# EAGLE design Bodenfeuchte_RFduino (EAGLE 7.0.0)
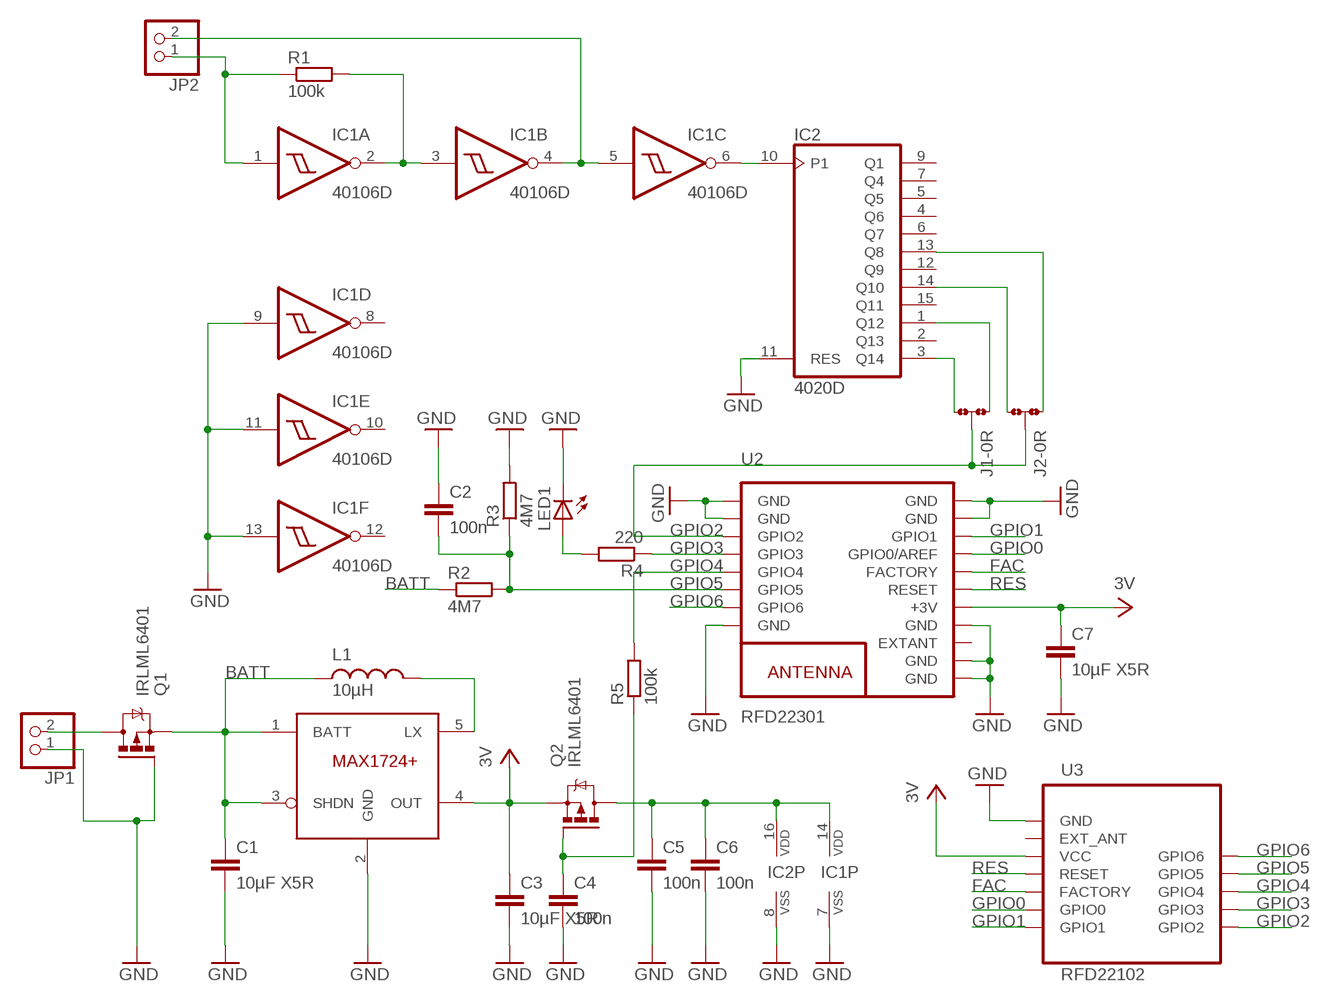
[diagram p0: schematic, sheet 1]

## Parts
C1  10µF X5R  C-EUC0805  [C0805]
C2  100n  C-EUC0805  [C0805]
C3  10µF X5R  C-EUC0805  [C0805]
C4  100n  C-EUC0805  [C0805]
C5  100n  C-EUC0805  [C0805]
C6  100n  C-EUC0805  [C0805]
C7  10µF X5R  C-EUC0805  [C0805]
IC1  40106D  [SO14]
IC2  4020D  [SO16]
J1  0R-JUMPA  [A0R-JMP]
J2  0R-JUMPA  [A0R-JMP]
JP1  PINHD-1X2  [1X02]
JP2  PINHD-1X2  [1X02]
L1  10µH  DS1608C  [DS1608]
LED1  LEDCHIPLED_1206  [CHIPLED_1206]
Q1  IRLML6401  IRLML5203  [MICRO3]
Q2  IRLML6401  IRLML5203  [MICRO3]
R1  100k  R-EU_R0805  [R0805]
R2  4M7  R-EU_R0805  [R0805]
R3  4M7  R-EU_R0805  [R0805]
R4  220  R-EU_R0805  [R0805]
R5  100k  R-EU_R0805  [R0805]
U1  MAX1724  [SOT23-5L]
U2  RFD22301  [RFD22301]
U3  RFD22102  [RFD22102]

## Nets
BATT: C1.1 L1.P$2 Q1.2(S) R2.1 U1.1(BATT) U1.3(SHDN)
FAC: U2.15(FACTORY) U3.FACTORY
GND: C1.2 C2.1 C3.2 C4.2 C5.2 C6.2 C7.2 IC1.7(P:VSS) IC1.9(D:I) IC1.11(E:I) IC1.13(F:I) IC2.8(VSS) IC2.11(RES) JP1.1 LED1.C Q1.1(G) R3.2 U1.2(GND) U2.1(GND) U2.2(GND) U2.8(GND) U2.9(GND) U2.10(GND) U2.12(GND) U2.18(GND) U2.19(GND) U3.GND
GPIO0: U2.16(GPIO0/AREF) U3.GPIO0
GPIO1: U2.17(GPIO1) U3.GPIO1
GPIO2: J1.2 J2.2 U2.3(GPIO2) U3.GPIO2
GPIO3: R4.1 U2.4(GPIO3) U3.GPIO3
GPIO4: R5.2 U2.5(GPIO4) U3.GPIO4
GPIO5: C2.2 R2.2 R3.1 U2.6(GPIO5) U3.GPIO5
GPIO6: U2.7(GPIO6) U3.GPIO6
N$1: L1.P$1 U1.5(LX)
N$2: JP1.2 Q1.3(D)
N$3: LED1.A R4.2
N$4: IC2.1(Q12) J1.1
N$5: IC1.6(C:O) IC2.10(P1)
N$6: IC1.4(B:O) IC1.5(C:I) JP2.2
N$7: IC1.2(A:O) IC1.3(B:I) R1.2
N$8: C4.1 Q2.1(G) R5.1
N$9: C5.1 C6.1 IC1.14(P:VDD) IC2.16(VDD) Q2.3(D)
N$10: IC1.1(A:I) JP2.1 R1.1
N$11: IC2.14(Q10) J2.3
N$12: IC2.13(Q8) J2.1
N$14: IC2.3(Q14) J1.3
RES: U2.14(RESET) U3.RESET
VCC: C3.1 C7.1 Q2.2(S) U1.4(OUT) U2.13(+3V) U3.VCC ; supply symbol labelled 3V
Unconnected: IC1.8(D:O) IC1.10(E:O) IC1.12(F:O) IC2.2(Q13) IC2.4(Q6) IC2.5(Q5) IC2.6(Q7) IC2.7(Q4) IC2.9(Q1) IC2.12(Q9) IC2.15(Q11) U2.11(EXTANT) U3.EXT_ANT

## Library data of the parts
C1-C7 = resistor:C-EU: CAPACITOR, European symbol
IC1 = 40xx:40106: Hex SCHMITT TRIGGER
IC2 = 40xx:4020: 14-stage binary/ripple COUNTER
J1 J2 = jump-0r-smd:0R-JUMP: SMD 0R 0805 Jumper
JP1 JP2 = pinhead:PINHD-1X2: PIN HEADER
L1 = inductor-coilcraft_2:DS1608: SMT Power Inductors
LED1 = led:LED: LED OSRAM: - CHIPLED LG R971, LG N971, LY N971, LG Q971, LY Q971, LO R971, LY R971 LH N974, LH R974 LS Q976, LO Q976, LY Q976 LO Q996 - Hyper CHIPLED LW Q18S LB Q993, LB Q99A, LB R99A - SideLED LS A670, LO A670, LY A670, LG A670, LP A670 LB A673, LV A673, LT A673, LW A673 LH A674 LY A675 LS A676, LA A676, LO A676, LY A676, LW A676 LS A679, LY A679, LG A679 - Hyper Micro SIDELED® LS Y876, LA Y876, LO Y876, LY Y876 LT Y87S - SmartLED LW L88C, LW L88S LB L89C, LB L89S, LG L890 LS L89K, LO L89K, LY L89K LS L896, LA L896, LO L896, LY L896 - TOPLED LS T670, LO T670, LY T670, LG T670, LP T670 LSG T670, LSP T670, LSY T670, LOP T670, LYG T670 LG T671, LOG T671, LSG T671 LB T673, LV T673, LT T673, LW T673 LH T674 LS T676, LA T676, LO T676, LY T676, LB T676, LH T676, LSB T676, LW T676 LB T67C, LV T67C, LT T67C, LS T67K, LO T67K, LY T67K, LW E67C LS E67B, LA E67B, LO E67B, LY E67B, LB E67C, LV E67C, LT E67C LW T67C LS T679, LY T679, LG T679 LS T770, LO T770, LY T770, LG T770, LP T770 LB T773, LV T773, LT T773, LW T773 LH T774 LS E675, LA E675, LY E675, LS T675 LS T776, LA T776, LO T776, LY T776, LB T776 LHGB T686 LT T68C, LB T68C - Hyper Mini TOPLED® LB M676 - Mini TOPLED Santana® LG M470 LS M47K, LO M47K, LY M47K Source: http://www.osram.convergy.de LUXEON: - LUMILED® LXK2-PW12-R00, LXK2-PW12-S00, LXK2-PW14-U00, LXK2-PW14-V00 LXK2-PM12-R00, LXK2-PM12-S00, LXK2-PM14-U00 LXK2-PE12-Q00, LXK2-PE12-R00, LXK2-PE12-S00, LXK2-PE14-T00, LXK2-PE14-U00 LXK2-PB12-K00, LXK2-PB12-L00, LXK2-PB12-M00, LXK2-PB14-N00, LXK2-PB14-P00, LXK2-PB14-Q00 LXK2-PR12-L00, LXK2-PR12-M00, LXK2-PR14-Q00, LXK2-PR14-R00 LXK2-PD12-Q00, LXK2-PD12-R00, LXK2-PD12-S00 LXK2-PH12-R00, LXK2-PH12-S00 LXK2-PL12-P00, LXK2-PL12-Q00, LXK2-PL12-R00 Source: www.luxeon.com KINGBRIGHT: KA-3528ASYC Source: www.kingbright.com
Q1 Q2 = transistor-power:IRLML5203: HEXFET P-Channel Power MOSFET
R1-R5 = rcl:R-EU_: RESISTOR, European symbol
U1 = MAX1724:MAX1724
U2 = RF_Digital_RFD22301_Eagle_Schematic_PCB_Library:RFD22301: RFD22301 RFduino SMT Module RFD22301 Datasheet: http://www.rfdigital.com/wp-content/uploads/2014/03/RFD22301.Data_.Sheet_.11.24.13_11.38PM.pdf
U3 = RF_Digital_RFD22102_Eagle_Schematic_PCB_Library:RFD22102: RFD22102 RFduino DIP module RFduino Datasheet: http://www.rfdigital.com/wp-content/uploads/2014/03/rfduino.datasheet.pdf

## Board
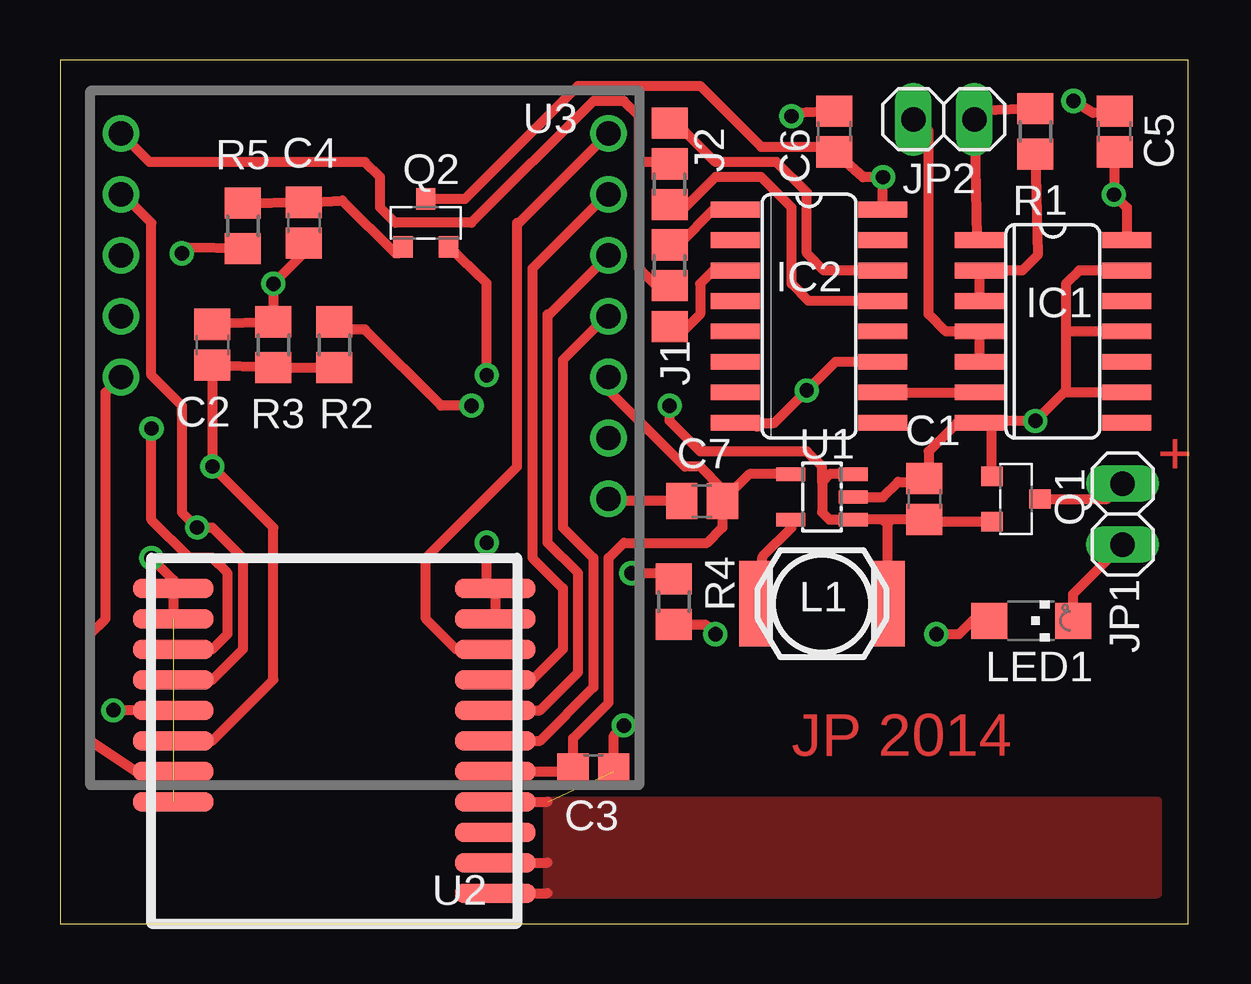
[diagram p1: board, top side]
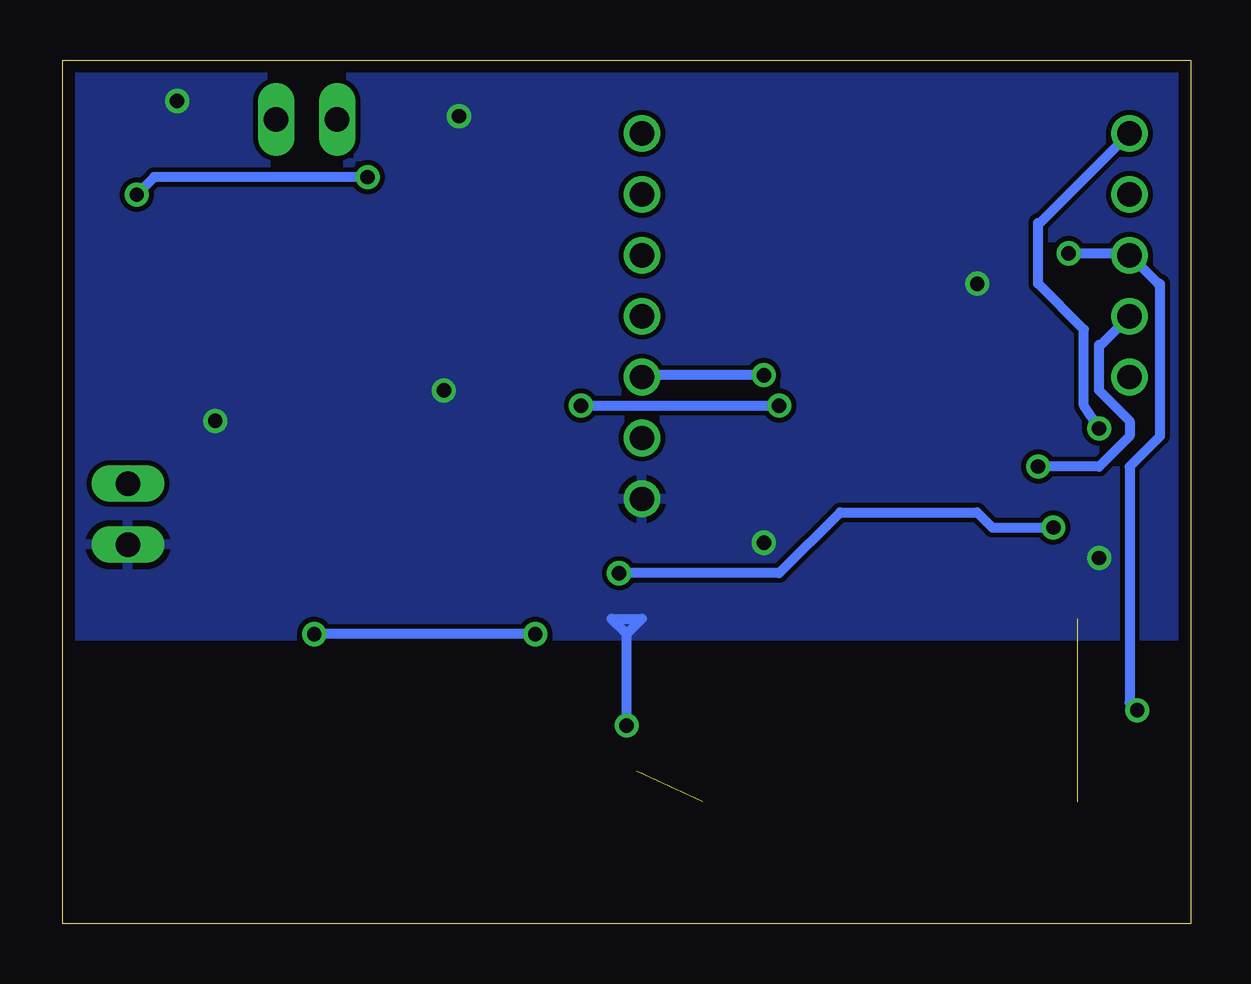
[diagram p2: board, bottom side, seen from below]

Size 47 x 36 mm. Coordinates in mm from the lower left corner, seen from the top.
Outline: 0,0 47,0 47,36 0,36 0,0
Copper layers (1*16): Top 0.035mm / dielectric 1.5mm / Bottom 0.035mm
Design rules "default *": minimum track width 10mil, minimum drill 13mil, track to track 8mil, track to pad 8mil, pad to pad 8mil, via to via 8mil, smd to smd 8mil, copper to edge 20mil, drill to drill 8mil, minimum pad ring 10mil, minimum via ring 8mil, stop-mask expansion 4mil, vias tented up to drill 0mil, thermal gap 10mil

### Footprints (pad centres in the part's own frame; a part is rotated, then mirrored left to right if it is on the bottom)
C0805 = smd 1.3 x 1.5: 1 -0.85,0; 2 0.85,0
SO14 = smd 0.66 x 2.032: 1 -3.81,-3.073; 2 -2.54,-3.073; 3 -1.27,-3.073; 4 0,-3.073; 5 1.27,-3.073; 6 2.54,-3.073; 7 3.81,-3.073; 8 3.81,3.073; 9 2.54,3.073; 10 1.27,3.073; 11 0,3.073; 12 -1.27,3.073; 13 -2.54,3.073; 14 -3.81,3.073
SO16 = smd 0.66 x 2.032: 1 -4.445,-3.073; 2 -3.175,-3.073; 3 -1.905,-3.073; 4 -0.635,-3.073; 5 0.635,-3.073; 6 1.905,-3.073; 7 3.175,-3.073; 8 4.445,-3.073; 9 4.445,3.073; 10 3.175,3.073; 11 1.905,3.073; 12 0.635,3.073; 13 -0.635,3.073; 14 -1.905,3.073; 15 -3.175,3.073; 16 -4.445,3.073
A0R-JMP = smd 1.5 x 1.3: 1 0,1.7; 2 0,0; 3 0,-1.7
1X02 = drill 1.016 long: 1 -1.27,0; 2 1.27,0
DS1608 = smd 1.397 x 3.556: P$1 -2.743,0; P$2 2.743,0
CHIPLED_1206 = smd 1.5 x 1.5: A 0,-1.75; C 0,1.75
MICRO3 = smd 0.8 x 0.9: 1 -0.95,-1; 2 0.95,-1; 3 0,1
R0805 = smd 1.3 x 1.5: 1 -0.95,0; 2 0.95,0
SOT23-5L = smd 0.55 x 1.2: 1 -0.95,-1.3; 2 0,-1.3; 3 0.95,-1.3; 4 0.95,1.3; 5 -0.95,1.3
RFD22301 = smd 3.353 x 0.813: 1 -6.706,7.62; 2 -6.706,6.35; 3 -6.706,5.08; 4 -6.706,3.81; 5 -6.706,2.54; 6 -6.706,1.27; 7 -6.706,0; 8 -6.706,-1.27; 9 6.706,-5.08; 10 6.706,-3.81; 11 6.706,-2.54; 12 6.706,-1.27; 13 6.706,0; 14 6.706,1.27; 15 6.706,2.54; 16 6.706,3.81; 17 6.706,5.08; 18 6.706,6.35; 19 6.706,7.62
RFD22102 = drill 1.016: EXT_ANT -10.16,0; FACTORY -10.16,-7.62; GND -10.16,2.54; GPIO0 -10.16,-10.16; GPIO1 -10.16,-12.7; GPIO2 10.16,-12.7; GPIO3 10.16,-10.16; GPIO4 10.16,-7.62; GPIO5 10.16,-5.08; GPIO6 10.16,-2.54; RESET -10.16,-5.08; VCC -10.16,-2.54

### Placement (x,y rotation side)
C1  36.02,17.7 90 top
C2  6.35,24.13 270 top
C3  22.23,6.35 0 top
C4  10.16,29.21 270 top
C5  43.94,33.02 90 top
C6  32.26,33.02 90 top
C7  26.75,17.61 180 top
IC1  41.37,24.68 270 top
IC2  31.21,25.32 270 top
J1  25.4,26.59 0 top
J2  25.4,31.67 180 top
JP1  44.27,17.07 90 top
JP2  36.83,33.53 180 top
L1  31.75,13.34 0 top
LED1  40.47,12.62 270 top
Q1  39.83,17.7 270 top
Q2  15.24,29.21 0 top
R1  40.64,33.02 270 top
R2  11.43,24.13 270 top
R3  8.89,24.13 90 top
R4  25.57,13.41 270 top
R5  7.62,29.08 270 top
U1  31.75,17.78 90 top
U2  11.43,6.35 0 top
U3  12.7,20.24 180 top

### Tracks (layer width: path | path; a pad name or v marks a point on that pad's centre or on a via)
BATT  (via drill 0.6)
  Top 0.406: v17.14,21.59 15.88,21.59 12.7,24.77 11.66,24.77 R2.1 | U1.3 32.06,18.73 31.75,18.41 | 31.75,18.41 31.75,17.14 32.06,16.83 U1.1 33.07,16.85 34.29,16.85 | 34.29,16.85 C1.1 36.12,16.75 Q1.2 | 31.75,18.41 31.75,19.05 31.11,19.68 26.67,19.68 25.4,20.95 v25.4,21.59 | L1.P$2 34.49,16.65 34.29,16.85
  Bottom 0.406: v25.4,21.59 v17.14,21.59
FAC
  Top 0.406: U3.FACTORY 20.4,25.4 20.32,25.4 20.32,15.88 21.59,14.61 21.59,10.48 20,8.89 U2.15
GND  (via drill 0.6)  (2 unrouted)
  Top 0.406: C4.2 10.16,27.94 v8.89,26.67 R3.2 6.45,25 C2.1 | U2.2 U2.1 4.72,14.33 v3.81,15.24 | U2.18 U2.19 17.78,13.97 v17.78,15.88 | C6.2 30.61,33.79 v30.48,33.66 | IC1.9 41.83,22.14 | 41.83,22.14 v40.64,20.95 38.73,20.95 | IC2.8 29.21,20.88 | 29.21,20.88 29.77,20.88 v31.11,22.23 32.3,23.41 IC2.11 | 29.04,20.7 29.21,20.88 | IC1.13 42.47,27.23 41.91,26.67 41.91,24.77 | 41.91,24.77 41.91,22.23 41.83,22.14 | IC1.11 41.99,24.68 41.91,24.77 | U1.2 34.29,17.78 34.92,18.41 35.88,18.41 C1.2 36.2,18.73 36.2,19.68 37.38,20.88 IC1.7 38.38,20.95 38.73,20.95 | C5.2 43.05,33.79 v42.23,34.29 | Q1.1 38.83,20.86 38.73,20.95 | 26.04,17.47 C7.2 22.95,17.61 U3.GND | C3.2 23.07,7.83 v23.5,8.26 | U2.12 20.32,5.08 | U2.10 20.32,2.54 | U2.9 20.32,1.27 | LED1.C 42.22,13.73 JP1.1
  Bottom 0.406: v23.5,8.26 23.5,12.06 | 23.5,12.06 24.13,12.7 22.86,12.7 23.5,12.06
  pour Bottom: 0,12 47,12 47,36 0,36
  pour Top: 20.32,1.27 45.72,1.27 45.72,5.08 20.32,5.08
GPIO0
  Top 0.406: U2.16 19.68,10.16 20.95,11.43 20.95,13.97 19.68,15.24 19.68,27.3 22.78,30.4 U3.GPIO0
GPIO1
  Top 0.406: U2.17 16.51,11.43 15.24,12.7 15.24,15.24 19.05,19.05 19.05,29.21 19.13,29.21 U3.GPIO1
GPIO2  (via drill 0.6)
  Top 0.406: U2.3 6.35,11.43 6.99,12.06 6.99,14.61 6.35,15.24 5.4,15.24 3.81,16.83 v3.81,20.64 | J1.2 24.84,26.59 24.13,27.3 24.13,31.75 | 24.13,31.75 24.13,33.66 23.5,34.29 22.23,34.29 17.14,29.21 13.97,29.21 13.34,29.84 13.34,31.11 12.7,31.75 3.73,31.75 U3.GPIO2 | J2.2 25.32,31.75 24.13,31.75
  Bottom 0.406: v3.81,20.64 4.45,21.59 4.45,24.77 6.35,26.67 6.35,29.21 6.27,29.21 U3.GPIO2
GPIO3  (via drill 0.6)
  Top 0.406: U3.GPIO3 2.62,30.4 3.81,29.21 3.81,22.86 5.08,21.59 5.08,17.14 v5.71,16.51 6.35,16.51 7.62,15.24 7.62,11.43 6.35,10.16 U2.4 | v23.81,14.61 25.34,14.61 R4.1
  Bottom 0.406: v5.71,16.51 8.26,16.51 8.89,17.14 14.61,17.14 17.14,14.61 v23.81,14.61
GPIO4  (via drill 0.6)
  Top 0.406: U2.5 v2.22,8.89 | R5.2 5.32,28.18 v5.08,27.94
  Bottom 0.406: v5.08,27.94 2.62,27.94 U3.GPIO4 1.35,26.67 1.27,26.67 1.27,20.32 2.54,19.05 2.54,9.21 v2.22,8.89
GPIO5  (via drill 0.6)
  Top 0.406: R2.2 R3.1 8.79,23.2 C2.2 v6.35,19.05 8.89,16.51 8.89,10.16 6.35,7.62 U2.6
  Bottom 0.406: U3.GPIO5 3.73,24.13 3.81,24.13 3.81,22.23 2.54,20.95 2.54,20.32 3.81,19.05 v6.35,19.05
GPIO6
  Top 0.406: U2.7 3.17,6.35 1.27,7.62 1.27,12.06 1.91,12.7 1.91,22.14 U3.GPIO6
N$1
  Top 0.406: L1.P$1 29.29,15.32 30.48,16.51 30.48,16.8 U1.5
N$2
  Top 0.406: Q1.3 43.64,17.7 JP1.2
N$3  (via drill 0.6)
  Top 0.406: R4.2 26.91,12.46 v27.3,12.06 | v36.51,12.06 37.47,12.06 38.1,12.7 38.63,12.7 LED1.A
  Bottom 0.406: v27.3,12.06 v36.51,12.06
N$4
  Top 0.406: J1.1 25.75,28.29 27.3,29.84 28.06,29.84 IC2.1
N$5
  Top 0.406: IC2.10 IC1.6
N$6
  Top 0.406: IC1.5 IC1.4 36.91,24.68 36.2,25.4 36.2,33.03 JP2.2
N$7
  Top 0.406: R1.2 40.73,27.86 40.1,27.23 IC1.2 IC1.3
N$8
  Top 0.406: R5.1 10.1,30.08 C4.1 11.77,30.14 13.97,27.94 14.1,27.94 Q2.1
N$9  (via drill 0.6)
  Top 0.406: IC2.16 v34.28,31.11 | v34.28,31.11 v34.29,31.11 | v34.28,31.11 33.46,31.11 C6.1 32.19,32.38 29.21,32.38 26.67,34.92 21.59,34.92 16.88,30.21 Q2.3 | 44.45,31.75 44.11,32.09 C5.1 v43.91,30.39 44.45,29.84 44.45,28.5 IC1.14
  Bottom 0.406: v34.29,31.11 43.18,31.11 v43.91,30.39
N$10
  Top 0.406: R1.1 38.52,33.89 JP2.1 38.2,28.6 IC1.1
N$11
  Top 0.406: IC2.14 31.83,27.23 31.11,27.94 31.11,30.48 29.84,31.75 27.3,31.75 26.04,33.02 25.75,33.02 J2.3
N$12
  Top 0.406: IC2.13 31.2,25.95 30.48,26.67 30.48,29.84 29.21,31.11 27.3,31.11 26.04,29.84 25.52,29.84 J2.1
N$14
  Top 0.406: IC2.3 27.23,27.23 26.67,26.67 26.67,25.4 26.04,24.77 25.52,24.77 J1.3
RES
  Top 0.406: U3.RESET 22.78,25.32 20.95,23.5 20.95,16.51 22.23,15.24 22.23,9.84 20,7.62 U2.14
VCC  (via drill 0.6)
  Top 0.406: v17.78,22.86 17.78,26.7 Q2.2 | U1.4 28.73,18.73 C7.1 | C7.1 27.6,18.12 26.67,19.05 26.04,19.05 22.86,22.23 U3.VCC | C7.1 27.6,16.51 26.96,15.88 23.5,15.88 22.86,15.24 22.86,9.21 21.38,7.72 C3.1 U2.13
  Bottom 0.406: v17.78,22.86 22.78,22.86 U3.VCC

### Text on the board
Top: + | JP 2014